# Altium project PPCB_Programming_Adaptor.PrjPcb
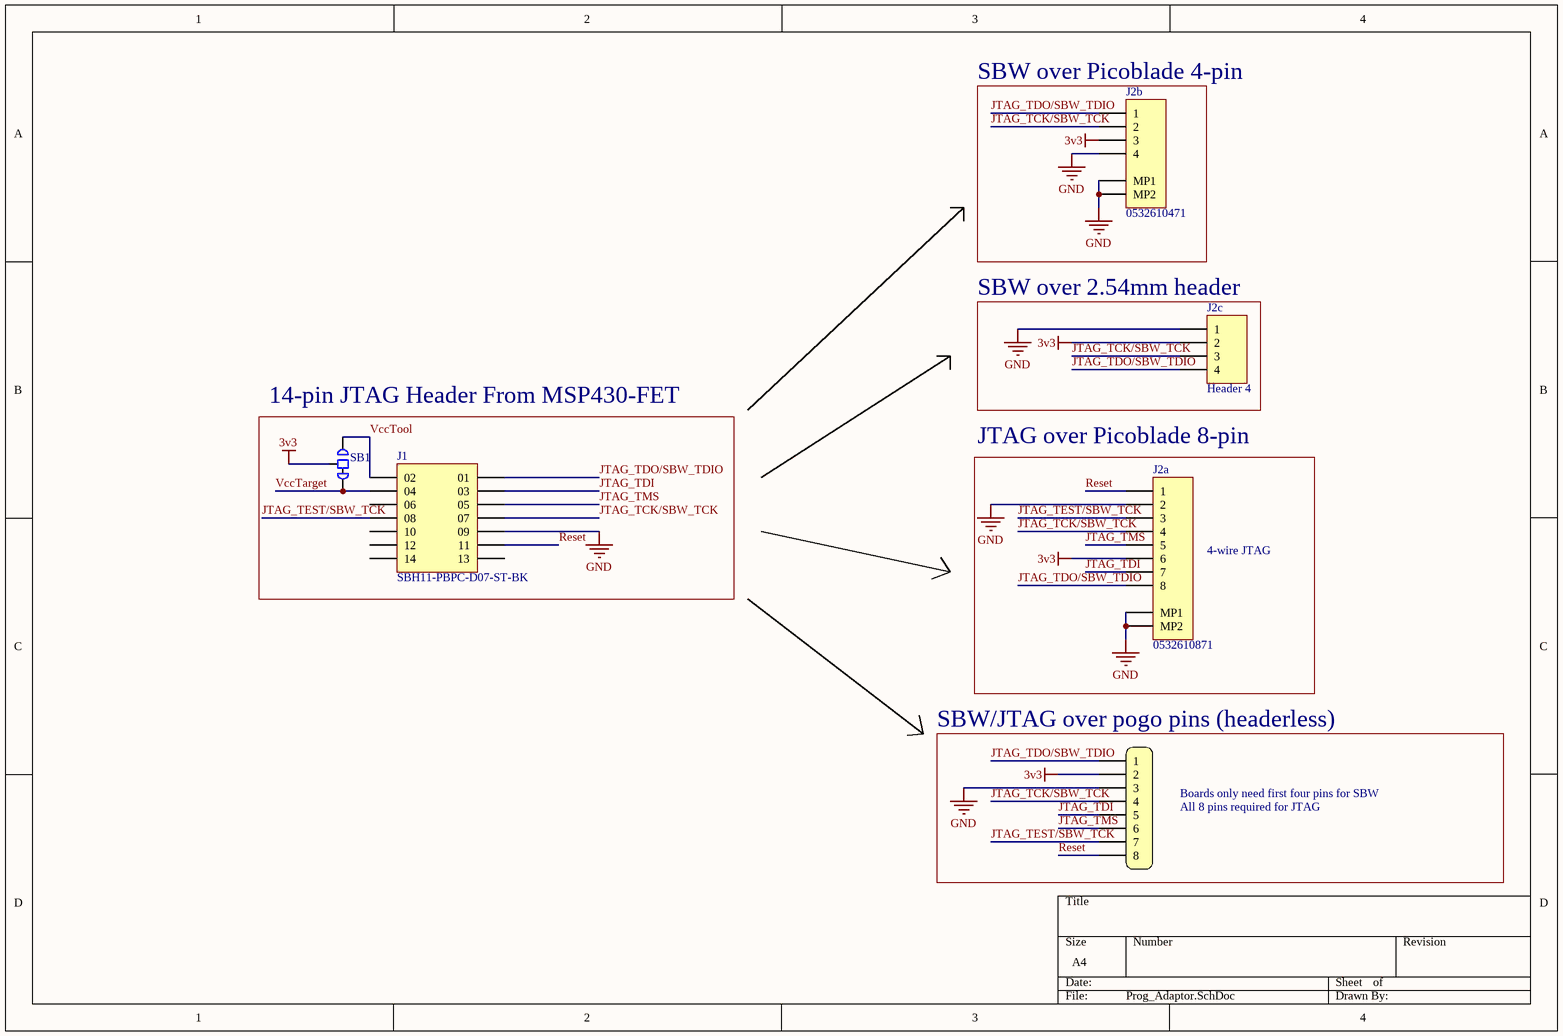
[diagram p0: Prog_Adaptor.SchDoc]
1 sheet, 6 parts. Net scope: global (net labels, ports and power ports of the same name join across sheets).
Board file: Prog_Adaptor.PcbDoc

## Sheet Prog_Adaptor.SchDoc
size A4

### Parts
J1  SBH11-PBPC-D07-ST-BK  [SBH11-PBPC-D07-ST-BK]
J2a  0532610871  [MOLEX_0532610871]
J2b  0532610471  [MOLEX_0532610471]
J2c  Header 4  [HDR1X4]
J2d  *  [POGO_8_PIN_HEADER]  (value not drawn)  (no BOM)
SB1  Solder Jumper 3-pin Left connected 0201  [Solder Bridge 3-pin Left shorted 0201]  (value not drawn)  (net tie, no BOM)

### Blocks framed on the sheet
SBW over Picoblade 4-pin: J2b
SBW over 2.54mm header: J2c
14-pin JTAG Header From MSP430-FET: J1 SB1
JTAG over Picoblade 8-pin: J2a
SBW/JTAG over pogo pins (headerless): J2d

### Nets
3v3: J2a.6 J2b.3 J2c.2 J2d.2 SB1.1(Common)
GND: J1.09 J2a.2 J2a.MP1 J2a.MP2 J2b.4 J2b.MP1 J2b.MP2 J2c.1 J2d.3
JTAG_TCK/SBW_TCK: J1.07 J2a.4 J2b.2 J2c.3 J2d.4
JTAG_TDI: J1.03 J2a.7 J2d.5
JTAG_TDO/SBW_TDIO: J1.01 J2a.8 J2b.1 J2c.4 J2d.1
JTAG_TEST/SBW_TCK: J1.08 J2a.3 J2d.7
JTAG_TMS: J1.05 J2a.5 J2d.6
Reset: J1.11 J2a.1 J2d.8
VccTarget: J1.04 SB1.2
VccTool: J1.02 SB1.3

Not connected (* = marked no-connect by the designer): J1 06 10 12 13 14

### Notes on the sheet
- 4-wire JTAG
- All 8 pins required for JTAG
- Boards only need first four pins for SBW

### Library data of the parts
J1 = SBH11-PBPC-D07-ST-BK: 14-pin JTAG Male Header
J2a = 0532610871: Header - Picoblade 08-pin, SMT, RA; Pitch: 1.25mm; Mounting Type: Surface Mount; Orientation: Right Angle; Pins: 8; Supplier 1: Digikey; Supplier 1 Part No.: WM7626CT-ND; MF Part No.: 0532610871
J2b = 0532610471: Header - Picoblade 04-pin, SMT, RA; Pitch: 1.25mm; Mounting Type: Surface Mount; Orientation: Right Angle; Pins: 4; Supplier 1: Digikey; Supplier 1 Part No.: WM7622CT-ND; MF Part No.: 0532610471
J2c = Header 4: Header, 4-Pin; LatestRevisionDate: 17-Jul-2002; LatestRevisionNote: Re-released for DXP Platform.; Publisher: Altium Limited
J2d = Headerless Pogo Holes 8-pin
SB1 = Solder Jumper 3-pin Normally Closed 0201: DEBUG: DEBUG